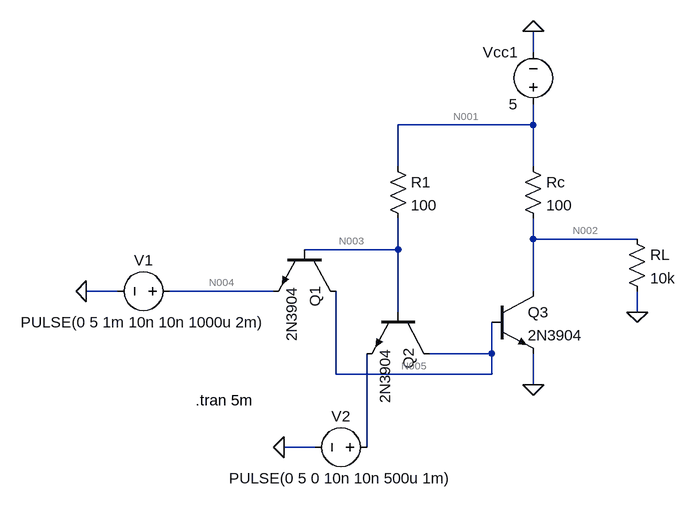
[diagram p0: schematic TTL_NAND.asc]
TTL_NAND.asc, the LTspice schematic file:
Version 4
SHEET 1 880 680
WIRE 336 -96 336 -128
WIRE 336 16 336 -16
WIRE 336 16 128 16
WIRE 128 80 128 16
WIRE 336 80 336 16
WIRE 336 192 336 160
WIRE 496 192 336 192
WIRE 128 208 128 160
WIRE 128 208 -16 208
WIRE -304 272 -352 272
WIRE -64 272 -224 272
WIRE 336 272 336 192
WIRE 128 304 128 208
WIRE 496 304 496 272
WIRE 272 368 272 320
WIRE 272 368 176 368
WIRE 32 400 32 272
WIRE 272 400 272 368
WIRE 272 400 32 400
WIRE 336 416 336 368
WIRE 0 512 -48 512
WIRE 80 512 80 368
FLAG 336 416 0
FLAG -48 512 0
FLAG 336 -128 0
FLAG 496 304 0
FLAG -352 272 0
SYMBOL voltage 336 0 R180
WINDOW 0 24 96 Left 2
WINDOW 3 24 16 Left 2
SYMATTR InstName Vcc1
SYMATTR Value 5
SYMBOL voltage 96 512 R90
WINDOW 0 -32 56 VBottom 2
WINDOW 3 32 56 VTop 2
WINDOW 123 0 0 Left 0
WINDOW 39 0 0 Left 0
SYMATTR InstName V2
SYMATTR Value PULSE(0 5 0 10n 10n 500u 1m)
SYMBOL npn 176 304 R90
SYMATTR InstName Q2
SYMATTR Value 2N3904
SYMBOL res 112 64 R0
SYMATTR InstName R1
SYMATTR Value 100
SYMBOL res 320 64 R0
SYMATTR InstName Rc
SYMATTR Value 100
SYMBOL npn 272 272 R0
SYMATTR InstName Q3
SYMATTR Value 2N3904
SYMBOL res 480 176 R0
SYMATTR InstName RL
SYMATTR Value 10k
SYMBOL npn 32 208 R90
SYMATTR InstName Q1
SYMATTR Value 2N3904
SYMBOL voltage -208 272 R90
WINDOW 0 -32 56 VBottom 2
WINDOW 3 32 56 VTop 2
WINDOW 123 0 0 Left 0
WINDOW 39 0 0 Left 0
SYMATTR InstName V1
SYMATTR Value PULSE(0 5 1m 10n 10n 1000u 2m)
TEXT -184 440 Left 2 !.tran 5m

The netlist it stands for:
* TTL_NAND.asc
Vcc1 N001 0 5
V2 N006 0 PULSE(0 5 0 10n 10n 500u 1m)
Q2 N005 N003 N006 0 2N3904
R1 N001 N003 100
Rc N001 N002 100
Q3 N002 N005 0 0 2N3904
RL N002 0 10k
Q1 N005 N003 N004 0 2N3904
V1 N004 0 PULSE(0 5 1m 10n 10n 1000u 2m)
.model NPN NPN
.model PNP PNP
.lib standard.bjt
.tran 5m
.backanno
.end

* Results of the author's LTspice run, read from the files saved beside the schematic
* Operating Point, zero values left out:
*   V(n001) = 5 V
*   V(n005) = 8.774 mV
*   V(n003) = 1.16 V
*   V(n002) = 4.95 V
*   Ic(Q1) = 2.468 pA
*   Ib(Q1) = 19.2 mA
*   Ie(Q1) = -19.2 mA
*   Ic(Q3) = 4.965 pA
*   Ib(Q3) = -4.935 pA
*   Ic(Q2) = 2.468 pA
*   Ib(Q2) = 19.2 mA
*   Ie(Q2) = -19.2 mA
*   I(Rl) = 495 µA
*   I(Rc) = 495 µA
*   I(R1) = 38.4 mA
*   I(V1) = 19.2 mA
*   I(V2) = 19.2 mA
*   I(Vcc1) = -38.9 mA
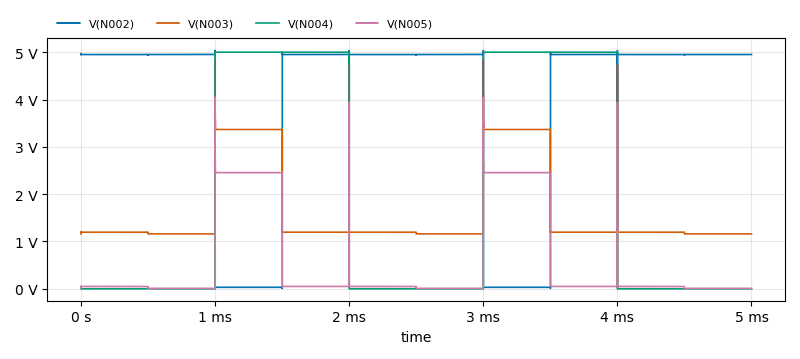
[diagram p1: Transient Analysis of TTL_NAND.asc, plotted from the saved traces]
* Transient Analysis, 1 run:
*   V(N002): min 7.759 mV, max 5.038 V, average 3.964 V, rms 4.427 V, last 4.95 V
*   V(N003): min 1.158 V, max 4.842 V, average 1.62 V, rms 1.841 V, last 1.16 V
*   V(N004): min 0 V, max 5 V, average 2 V, rms 3.162 V, last 0 V
*   V(N005): min 7.476 mV, max 4.051 V, average 518.8 mV, rms 1.099 V, last 8.774 mV